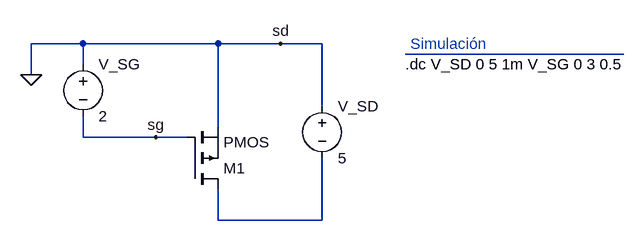
[diagram p0: schematic pMOS_vi.asc]
pMOS_vi.asc, the LTspice schematic file:
Version 4
SHEET 1 880 680
WIRE -432 -80 -512 -80
WIRE -224 -80 -432 -80
WIRE -128 -80 -224 -80
WIRE -64 -80 -128 -80
WIRE 400 -64 64 -64
WIRE -432 -48 -432 -80
WIRE -512 -32 -512 -80
WIRE -64 16 -64 -80
WIRE -224 48 -224 -80
WIRE -432 64 -432 32
WIRE -320 64 -432 64
WIRE -272 64 -320 64
WIRE -224 192 -224 144
WIRE -64 192 -64 96
WIRE -64 192 -224 192
FLAG -512 -32 0
FLAG -320 64 sg
FLAG -128 -80 sd
SYMBOL voltage -432 -64 R0
WINDOW 123 0 0 Left 0
WINDOW 39 0 0 Left 0
SYMATTR InstName V_SG
SYMATTR Value 2
SYMBOL voltage -64 0 R0
WINDOW 123 0 0 Left 0
WINDOW 39 0 0 Left 0
SYMATTR InstName V_SD
SYMATTR Value 5
SYMBOL pmos -272 144 M180
SYMATTR InstName M1
TEXT 64 -48 Left 2 !.dc V_SD 0 5 1m V_SG 0 3 0.5
TEXT 72 -80 Left 2 ;Simulación

The netlist it stands for:
* pMOS_vi.asc
V_SG 0 sg 2
V_SD 0 N002 5
M1 N002 sg 0 0 PMOS
.model NMOS NMOS
.model PMOS PMOS
.lib standard.mos
.dc V_SD 0 5 1m V_SG 0 3 0.5
* Simulación
.backanno
.end